# EAGLE design imu_hand (EAGLE 9.1.3)

## Sheet 1 of 2
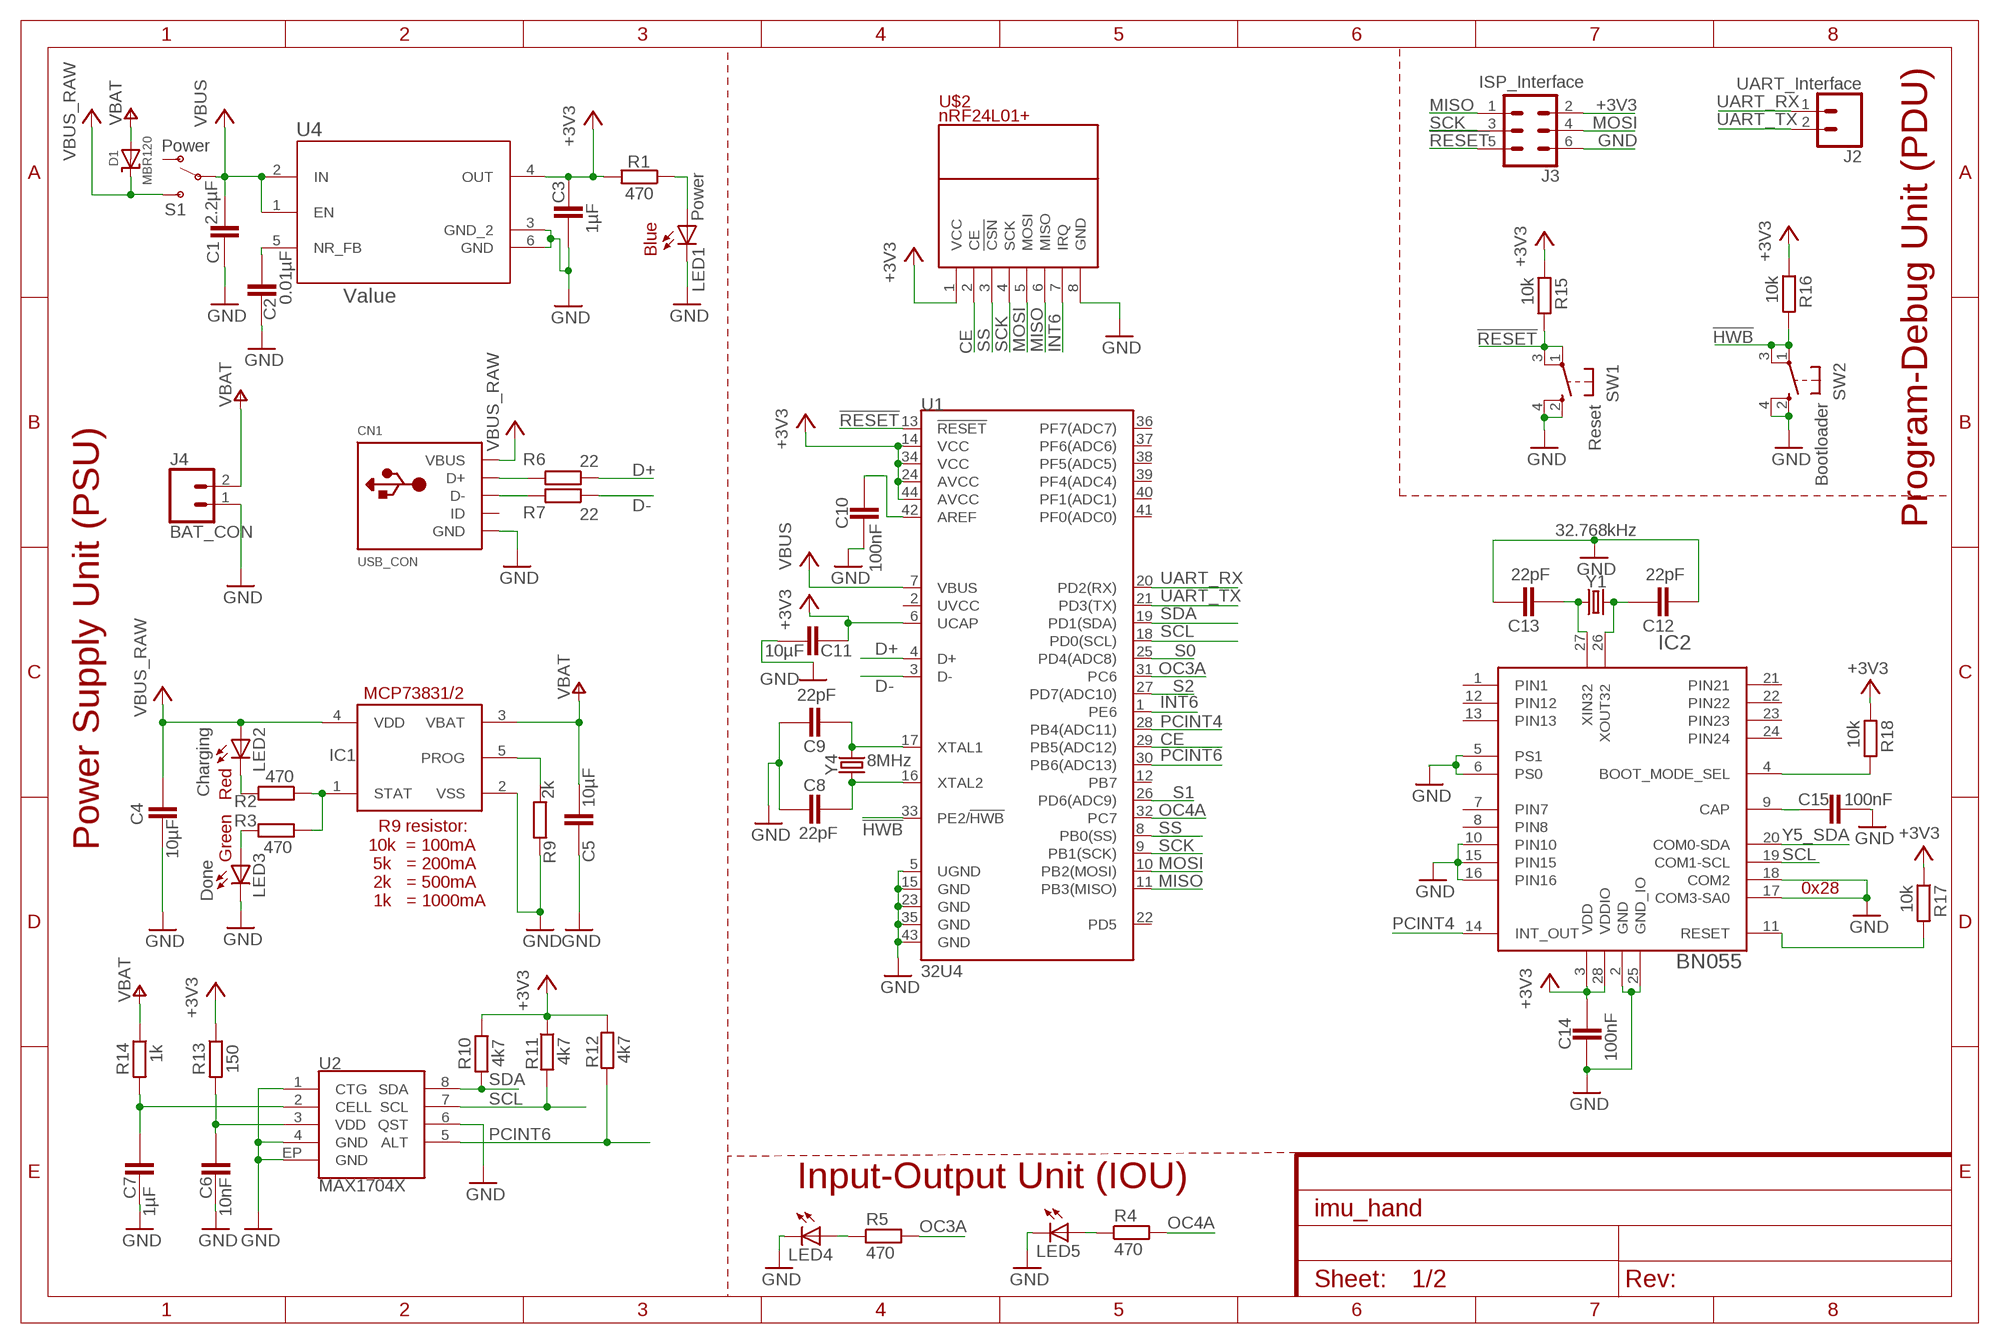
[diagram p0: schematic, sheet 1]

### Parts
C1  2.2µF  CAPACITOR_0603  [CAPC1608X92N]
C2  0.01µF  CAPACITOR_0603  [CAPC1608X92N]
C3  1µF  CAPACITOR_0603  [CAPC1608X92N]
C4  10µF  CAPACITOR_0603  [CAPC1608X92N]
C5  10µF  CAPACITOR_0603  [CAPC1608X92N]
C6  10nF  CAPACITOR_0603  [CAPC1608X92N]
C7  1µF  CAPACITOR_0603  [CAPC1608X92N]
C8  22pF  CAPACITOR_0603  [CAPC1608X92N]
C9  22pF  CAPACITOR_0603  [CAPC1608X92N]
C10  100nF  CAPACITOR_0603  [CAPC1608X92N]
C11  10µF  CAPACITOR_0603  [CAPC1608X92N]
C12  22pF  CAPACITOR_0603  [CAPC1608X92N]
C13  22pF  CAPACITOR_0603  [CAPC1608X92N]
C14  100nF  CAPACITOR_0603  [CAPC1608X92N]
C15  100nF  CAPACITOR_0603  [CAPC1608X92N]
CN1  USB_CON  USBMINIB  [USB-MINIB]
D1  MBR120  DIODE_SOD-123FL  [SOD-123FL]
IC1  MCP73831/OT  [SOT23-5L]
IC2  BN055  1658_BNO055  [LGA-28_3.80X5.20/0.5]
J2  UART_Interface  CONN_02  [1X02]
J3  ISP_Interface  CONN_03X2FEMALE  [2X3]
J4  BAT_CON  CONN_02  [1X02]
LED1  Power  LEDCHIPLED_0603  [CHIPLED_0603]
LED2  Charging  LEDCHIPLED_0603  [CHIPLED_0603]
LED3  Done  LEDCHIPLED_0603  [CHIPLED_0603]
LED4  LEDCHIPLED_0603  [CHIPLED_0603]
LED5  LEDCHIPLED_0603  [CHIPLED_0603]
R1  470  RESISTOR_0603  [RESC1608X55N]
R2  470  RESISTOR_0603  [RESC1608X55N]
R3  470  RESISTOR_0603  [RESC1608X55N]
R4  470  RESISTOR_0603  [RESC1608X55N]
R5  470  RESISTOR_0603  [RESC1608X55N]
R6  22  RESISTOR_0603  [RESC1608X55N]
R7  22  RESISTOR_0603  [RESC1608X55N]
R9  2k  RESISTOR_0603  [RESC1608X55N]
R10  4k7  RESISTOR_0603  [RESC1608X55N]
R11  4k7  RESISTOR_0603  [RESC1608X55N]
R12  4k7  RESISTOR_0603  [RESC1608X55N]
R13  150  RESISTOR_0603  [RESC1608X55N]
R14  1k  RESISTOR_0603  [RESC1608X55N]
R15  10k  RESISTOR_0603  [RESC1608X55N]
R16  10k  RESISTOR_0603  [RESC1608X55N]
R17  10k  RESISTOR_0603  [RESC1608X55N]
R18  10k  RESISTOR_0603  [RESC1608X55N]
S1  Power  SWITCH-SPDT-PTH-11.6X4.0MM  [SWITCH_SPDT_PTH_11.6X4.0MM]
SW1  Reset  SPST_TACT-KMR2  [KMR2]
SW2  Bootloader  SPST_TACT-KMR2  [KMR2]
U1  32U4  ATMEGA32U4TQFP-44  [TQFP44]
U2  MAX1704X  [TDFN-8]
U4  Value  TPS79633QDCQRQ1  [DCQ0006A_N]
U$2  nRF24L01+  6-PIN-BREAKOUT6-PIN-BREAKOUT  [6-PIN-BREAKOUT]
Y1  32.768kHz  CRYSTAL-32.768KHZSMD-3.2X1.5  [CRYSTAL-SMD-3.2X1.5MM]
Y4  8MHz  CRYSTAL-8MHZSMD-5X3.2  [CRYSTAL-SMD-5X3.2-4PAD]

### Nets
!HWB!: R16.2 SW2.1(P) SW2.3(P1) U1.33(PE2/!HWB)
!RESET!: J3.5 R15.2 SW1.1(P) SW1.3(P1) U1.13(!RESET)
+3V3: C3.2 C11.1 C14.1 IC2.3(VDD) IC2.28(VDDIO) J3.2 R1.2 R10.1 R11.1 R12.1 R13.1 R15.1 R16.1 R17.1 R18.1 U1.6(UCAP) U1.14(VCC) U1.24(AVCC) U1.34(VCC) U1.44(AVCC) U4.4(OUT) U$2.1(VCC) ; also sheet 2
CE: U1.29(PB5(ADC12)) U$2.2(CE)
D+: R6.1 U1.4(D+)
D-: R7.1 U1.3(D-)
GND: C1.1 C2.1 C3.1 C4.1 C5.1 C6.1 C7.1 C8.2 C9.2 C10.2 C11.2 C12.1 C13.2 C14.2 C15.2 CN1.GND IC1.2(VSS) IC2.2(GND) IC2.5(PS1) IC2.6(PS0) IC2.10(PIN10) IC2.15(PIN15) IC2.16(PIN16) IC2.17(COM3-SA0) IC2.18(COM2) IC2.25(GND_IO) J3.6 J4.1 LED1.C LED3.C LED4.C LED5.C R9.2 SW1.2(S) SW1.4(S1) SW2.2(S) SW2.4(S1) U1.5(UGND) U1.15(GND) U1.23(GND) U1.35(GND) U1.43(GND) U2.1(CTG) U2.4(GND) U2.6(QST) U2.EP(GND) U4.3(GND_2) U4.6(GND) U$2.8(GND) ; also sheet 2
INT6: U1.1(PE6) U$2.7(IRQ)
MISO: J3.1 U1.11(PB3(MISO)) U$2.6(MISO)
MOSI: J3.4 U1.10(PB2(MOSI)) U$2.5(MOSI)
N$1: CN1.D+ R6.2
N$2: CN1.D- R7.2
N$3: IC1.5(PROG) R9.1
N$4: LED2.C R2.2
N$5: C2.2 U4.5(NR_FB)
N$6: C13.1 IC2.27(XIN32) Y1.P$1
N$7: LED1.A R1.1
N$8: IC1.1(STAT) R2.1 R3.1
N$9: LED3.A R3.2
N$10: C9.1 U1.17(XTAL1) Y4.3
N$11: C8.1 U1.16(XTAL2) Y4.1
N$12: C10.1 U1.42(AREF)
N$13: C6.2 R13.2 U2.3(VDD)
N$14: C7.2 R14.2 U2.2(CELL)
N$15: LED4.A R5.1
N$16: C12.2 IC2.26(XOUT32) Y1.P$2
N$17: LED5.A R4.1
N$19: IC2.11(RESET) R17.2
N$20: C15.1 IC2.9(CAP)
N$21: IC2.4(BOOT_MODE_SEL) R18.2
OC3A: R5.2 U1.31(PC6)
OC4A: R4.2 U1.32(PC7)
PCINT4: IC2.14(INT_OUT) U1.28(PB4(ADC11))
PCINT6: R12.2 U1.30(PB6(ADC13)) U2.5(ALT)
S0: U1.25(PD4(ADC8)) ; also sheet 2
S1: U1.26(PD6(ADC9)) ; also sheet 2
S2: U1.27(PD7(ADC10)) ; also sheet 2
SCK: J3.3 U1.9(PB1(SCK)) U$2.4(SCK)
SCL: IC2.19(COM1-SCL) R11.2 U1.18(PD0(SCL)) U2.7(SCL) ; also sheet 2
SDA: R10.2 U1.19(PD1(SDA)) U2.8(SDA) ; also sheet 2
SS: U1.8(PB0(SS)) U$2.3(!CSN!)
UART_RX: J2.1 U1.20(PD2(RX))
UART_TX: J2.2 U1.21(PD3(TX))
VBAT: C5.2 D1.A IC1.3(VBAT) J4.2 R14.1
VBUS: C1.2 S1.2(P) U1.7(VBUS) U4.1(EN) U4.2(IN)
VBUS_RAW: C4.2 CN1.VBUS D1.C IC1.4(VDD) LED2.A S1.3(S)
Y5_SDA: IC2.20(COM0-SDA) ; also sheet 2
Unconnected: CN1.ID IC2.1(PIN1) IC2.7(PIN7) IC2.8(PIN8) IC2.12(PIN12) IC2.13(PIN13) IC2.21(PIN21) IC2.22(PIN22) IC2.23(PIN23) IC2.24(PIN24) S1.1(O) U1.2(UVCC) U1.12(PB7) U1.22(PD5) U1.36(PF7(ADC7)) U1.37(PF6(ADC6)) U1.38(PF5(ADC5)) U1.39(PF4(ADC4)) U1.40(PF1(ADC1)) U1.41(PF0(ADC0))

### Notes on the sheet
- Program-Debug Unit (PDU)
- nRF24L01+
- Blue
- Red
- Power Supply Unit (PSU)
- Green
- 0x28
- R9 resistor:
  10k  = 100mA
   5k   = 200mA
   2k   = 500mA
   1k   = 1000mA
- Input-Output Unit (IOU)

## Sheet 2 of 2
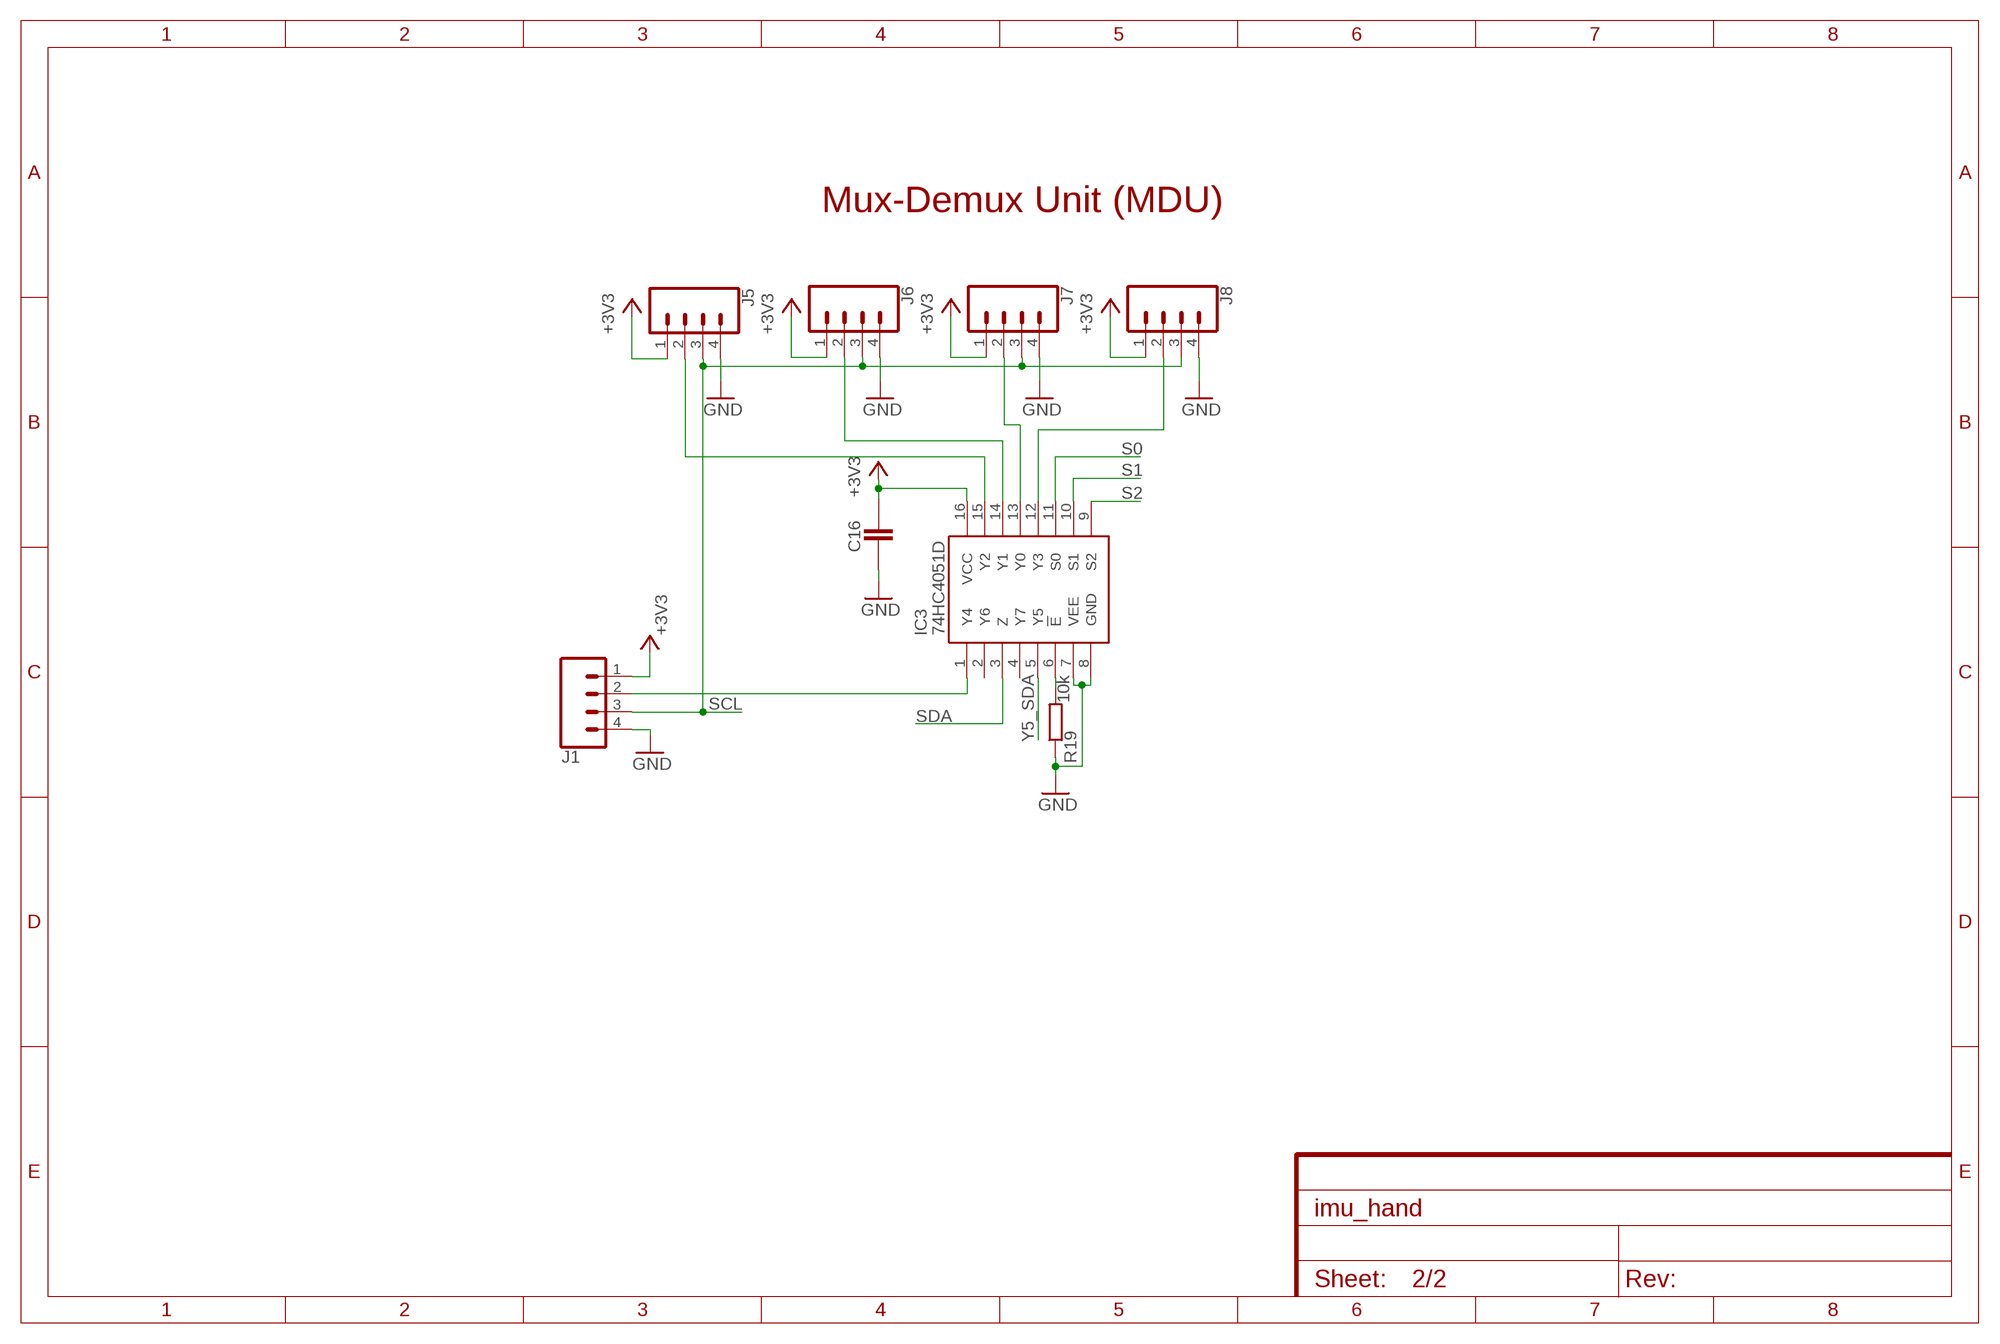
[diagram p1: schematic, sheet 2]

### Parts
C16  CAPACITOR_0603  [CAPC1608X92N]
IC3  74HC4051D  [SOIC127P600X175-16N]
J1  CONN_04SMD2  [1X04_1MM_RA]
J5  CONN_04SMD2  [1X04_1MM_RA]
J6  CONN_04SMD2  [1X04_1MM_RA]
J7  CONN_04SMD2  [1X04_1MM_RA]
J8  CONN_04SMD2  [1X04_1MM_RA]
R19  10k  RESISTOR_0603  [RESC1608X55N]

### Nets
+3V3: C16.2 IC3.16(VCC) J1.1 J5.1 J6.1 J7.1 J8.1 ; also sheet 1
GND: C16.1 IC3.7(VEE) IC3.8(GND) J1.4 J5.4 J6.4 J7.4 J8.4 R19.1 ; also sheet 1
N$18: IC3.1(Y4) J1.2
N$22: IC3.15(Y2) J5.2
N$23: IC3.14(Y1) J6.2
N$24: IC3.13(Y0) J7.2
N$25: IC3.12(Y3) J8.2
N$26: IC3.6(!E) R19.2
S0: IC3.11(S0) ; also sheet 1
S1: IC3.10(S1) ; also sheet 1
S2: IC3.9(S2) ; also sheet 1
SCL: J1.3 J5.3 J6.3 J7.3 J8.3 ; also sheet 1
SDA: IC3.3(Z) ; also sheet 1
Y5_SDA: IC3.5(Y5) ; also sheet 1
Unconnected: IC3.2(Y6) IC3.4(Y7)

### Notes on the sheet
- Mux-Demux Unit (MDU)

## Library data of the parts
C1-C16 = ipc-7351-capacitor:CAPACITOR_
CN1 = adafruit:USB: USB Connectors USBMINIB - Surface Mount Female Mini-B USB Connector 4UConnector: 06564 By microbuilder.eu Thru-hole RA Female Mini-B USB Connector 4UConnector: 18732 By ladyada.net
D1 = adafruit:DIODE: Diode SMADIODE - SMA Surface Mount Package 20V 1A Schottky Diode Digikey: 641-1014-6-ND DO-1N4148 - Through Hole Small Current Diode SOD-123 20V 1 A (.5mV Vf) Schottky Diode - Digikey: MBRX120TPMSCT-ND SOD-323 10V 570mA (.38mV Vf, 3ns) Schottky Diode - Digikey: ZLLS410CT-ND SOD-523 30V 30mA Schottky Diode (RB751S-40TE61) - Digikey: RB751S-40TE61CT-ND SOT23-R/W - SOT23 Package (R = Solder Paste/Reflow Ovens, W = Hand-Soldering) BAT54Film 40V 300mA - Digikey: 497-7162-1-ND
IC1 = adafruit:MCP73831: MCP73831/2 Miniature Single-Cell, Fully Integrated Li-Ion, Li-Polymer Charge Management Controllers. Nice and small simple lipoly charge controller, with adjustable current and status output (LED) http://www.ladyada.net/library/pcb/eaglelibrary.html
IC2 = BNO055:1658_BNO055: BN055 Intelligent 9-axis absolute orientation sensor; PART_NUMBER: BNO055
IC3 = 74HC4051D:74HC4051D: NXP 74HC4051D, Multiplexer/Demultiplexer Single 8:1, 5 V, 16-Pin SOIC Source: Datasheet <https://assets.nexperia.com/documents/data-sheet/74HC_HCT4051.pdf>; ARROW_PART_NUMBER: 74HC4051D; ARROW_PRICE-STOCK: http://uk.rs-online.com/web/p/products/1697756P; DESCRIPTION: NXP 74HC4051D, Multiplexer/Demultiplexer Single 8:1, 5 V, 16-Pin SOIC; HEIGHT: 1.75mm; MANUFACTURER_NAME: Nexperia; MANUFACTURER_PART_NUMBER: 74HC4051D; RS_PART_NUMBER: 1697756P; RS_PRICE-STOCK: http://uk.rs-online.com/web/p/products/1697756P
J1 J5-J8 = SparkFun-Connectors:CONN_04: Multi connection point. Often used as Generic Header-pin footprint for 0.1 inch spaced/style header connections On any of the 0.1 inch spaced packages, you can populate with these: Break Away Headers - Straight <https://www.sparkfun.com/products/116> (PRT-00116) Break Away Male Headers - Right Angle <https://www.sparkfun.com/products/553> (PRT-00553) Female Headers <https://www.sparkfun.com/products/115> (PRT-00115) Break Away Headers - Machine Pin <https://www.sparkfun.com/products/117> (PRT-00117) Break Away Female Headers - Swiss Machine Pin <https://www.sparkfun.com/products/743> (PRT-00743) For SCREWTERMINALS and SPRING TERMINALS visit here: Screw Terimnals on SparkFun.com <https://www.sparkfun.com/search/results?term=Screw+Terminals> (5mm/3.5mm/2.54mm spacing) This device is also useful as a general connection point to wire up your design to another part of your project. Our various solder wires solder well into these plated through hole pads. Hook-Up Wire - Assortment (Stranded, 22 AWG) <https://www.sparkfun.com/products/11375> (PRT-11375) Hook-Up Wire - Assortment (Solid Core, 22 AWG) <https://www.sparkfun.com/products/11367> (PRT-11367) View the entire wire category on our website here <https://www.sparkfun.com/categories/141> Special notes: Molex polarized connector foot print use with SKU : PRT-08231 with associated crimp pins and housings. 1MM SMD Version SKU: PRT-10208; PROD_ID: CONN-10310; SF_ID: PRT-10208
J2 J4 = SparkFun-Connectors:CONN_02: Multi connection point. Often used as Generic Header-pin footprint for 0.1 inch spaced/style header connections On any of the 0.1 inch spaced packages, you can populate with these: Break Away Headers - Straight <https://www.sparkfun.com/products/116> (PRT-00116) Break Away Male Headers - Right Angle <https://www.sparkfun.com/products/553> (PRT-00553) Female Headers <https://www.sparkfun.com/products/115> (PRT-00115) Break Away Headers - Machine Pin <https://www.sparkfun.com/products/117> (PRT-00117) Break Away Female Headers - Swiss Machine Pin <https://www.sparkfun.com/products/743> (PRT-00743) For SCREWTERMINALS and SPRING TERMINALS visit here: Screw Terimnals on SparkFun.com <https://www.sparkfun.com/search/results?term=Screw+Terminals> (5mm/3.5mm/2.54mm spacing) This device is also useful as a general connection point to wire up your design to another part of your project. Our various solder wires solder well into these plated through hole pads. Hook-Up Wire - Assortment (Stranded, 22 AWG) <https://www.sparkfun.com/products/11375> (PRT-11375) Hook-Up Wire - Assortment (Solid Core, 22 AWG) <https://www.sparkfun.com/products/11367> (PRT-11367) View the entire wire category on our website here <https://www.sparkfun.com/categories/141> Special notes: Molex polarized connector foot print use with: PRT-08233 with associated crimp pins and housings. 2.54_SCREWTERM for use with PRT-10571. 3.5mm Screw Terminal footprints for PRT-08084 5mm Screw Terminal footprints for use with PRT-08432
J3 = SparkFun-Connectors:CONN_03X2: Multi connection point. Often used as Generic Header-pin footprint for 0.1 inch spaced/style header connections You can populate with any combo of single row headers, but if you'd like an exact match, check these: Header - 2x3 (Male, 0.1") <https://www.sparkfun.com/products/12807> (PRT-12807) Header - 2x3 (Female, 0.1") <https://www.sparkfun.com/products/13010> (PRT-13010) 2x3 Pin Shrouded Header <https://www.sparkfun.com/products/10877> (PRT-10877) On any of the 0.1 inch spaced packages, you can populate with these: Break Away Headers - Straight <https://www.sparkfun.com/products/116> (PRT-00116) Break Away Male Headers - Right Angle <https://www.sparkfun.com/products/553> (PRT-00553) Female Headers <https://www.sparkfun.com/products/115> (PRT-00115) Break Away Headers - Machine Pin <https://www.sparkfun.com/products/117> (PRT-00117) Break Away Female Headers - Swiss Machine Pin <https://www.sparkfun.com/products/743> (PRT-00743) Special note: the shrouded connector mates well with our 3x2 ribbon cables: Ribbon Crimp Connector - 6-pin (2x3, Female) <https://www.sparkfun.com/products/10651> (PRT-10651) Ribbon Cable - 6 wire (15ft) <https://www.sparkfun.com/products/10646> (PRT-10646); PROD_ID: CONN-11566; VALUE: FEMALE 2x3
LED1-LED5 = adafruit:LED: LED OSRAM: - CHIPLED LG R971, LG N971, LY N971, LG Q971, LY Q971, LO R971, LY R971 LH N974, LH R974 LS Q976, LO Q976, LY Q976 LO Q996 - Hyper CHIPLED LW Q18S LB Q993, LB Q99A, LB R99A - SideLED LS A670, LO A670, LY A670, LG A670, LP A670 LB A673, LV A673, LT A673, LW A673 LH A674 LY A675 LS A676, LA A676, LO A676, LY A676, LW A676 LS A679, LY A679, LG A679 - Hyper Micro SIDELED® LS Y876, LA Y876, LO Y876, LY Y876 LT Y87S - SmartLED LW L88C, LW L88S LB L89C, LB L89S, LG L890 LS L89K, LO L89K, LY L89K LS L896, LA L896, LO L896, LY L896 - TOPLED LS T670, LO T670, LY T670, LG T670, LP T670 LSG T670, LSP T670, LSY T670, LOP T670, LYG T670 LG T671, LOG T671, LSG T671 LB T673, LV T673, LT T673, LW T673 LH T674 LS T676, LA T676, LO T676, LY T676, LB T676, LH T676, LSB T676, LW T676 LB T67C, LV T67C, LT T67C, LS T67K, LO T67K, LY T67K, LW E67C LS E67B, LA E67B, LO E67B, LY E67B, LB E67C, LV E67C, LT E67C LW T67C LS T679, LY T679, LG T679 LS T770, LO T770, LY T770, LG T770, LP T770 LB T773, LV T773, LT T773, LW T773 LH T774 LS E675, LA E675, LY E675, LS T675 LS T776, LA T776, LO T776, LY T776, LB T776 LHGB T686 LT T68C, LB T68C - Hyper Mini TOPLED® LB M676 - Mini TOPLED Santana® LG M470 LS M47K, LO M47K, LY M47K Source: http://www.osram.convergy.de/
R1-R7 R9-R19 = ipc-7351-resistor:RESISTOR_
S1 = SparkFun-Switches:SWITCH-SPDT: Single Pole, Double Throw (SPDT) Switch Single-pole, double-throw (SPDT) switch. Variant Overview SMD-AYZ0202 Surface Mount DPDT Switch <https://www.sparkfun.com/products/597> (COM-00597) Used on e.g. LilyPad Arduino USB - ATmega32U4 Board <https://www.sparkfun.com/products/12049> PTH-11.6X4.0MM SPDT Mini Power Switch <https://www.sparkfun.com/products/102> (COM-00102) Used on e.g. SparkFun Simon Says - Through-Hole Soldering Kit <https://www.sparkfun.com/products/10547> (KIT-10547) PTH-11.6X4.0MM-KIT KIT version of SPDT Mini Power Switch - Simplifies soldering by removing tStop of switch pins - only one side can be soldered. PTH-11.6X4.0MM-LOCK LOCK version of SPDT Mini Power Switch - Offset pins hold switch in place for easier soldering. SMD-RIGHT-ANGLE Surface Mount Right Angle Switch <https://www.sparkfun.com/products/10860> (COM-10860) Used on e.g. SparkFun ESP8266 Thing <https://www.sparkfun.com/products/13231>; PROD_ID: SWCH-08261; SF_SKU: COM-00102
SW1 SW2 = adafruit:SPST_TACT: SMT 6mm switch, EVQQ2 series http://www.ladyada.net/library/eagle
U1 = SparkFun-IC-Microcontroller:ATMEGA32U4: Atmel MCU, 32KByte Atmel 44-pin 8-bit Microcontroller with 32KBytes of ISP Flash and USB Controller Datasheet <http://cdn.sparkfun.com/datasheets/Dev/Arduino/Boards/ATMega32U4.pdf> SparkFun Products LilyPad Arduino USB - ATmega32U4 Board <https://www.sparkfun.com/products/12049> (DEV-12049) Pro Micro - 5V/16MHz <https://www.sparkfun.com/products/12640> (DEV-12640) Pro Micro - 3.3V/8MHz <https://www.sparkfun.com/products/12587> (DEV-12587) Fio v3 - ATmega32U4 <https://www.sparkfun.com/products/11520> (DEV-11520) Qduino Mini <https://www.sparkfun.com/products/13614> (DEV-13614) Makey Makey - Standard Kit <https://www.sparkfun.com/products/11511> (WIG-11511) Makey Makey Deluxe Kit <https://www.sparkfun.com/products/11519> (WIG-11519); PROD_ID: IC-11161
U2 = SparkFun-IC-Power:MAX1704X: MAX17043/MAX17044: Battery Fuel Guage (43 is 1cell, 44 is 2cell); PROD-ID: IC-10399
U4 = TPS79633-Q1:TPS79633QDCQRQ1; MANUFACTURER: Texas Instruments; PARTNUMBER: TPS79633QDCQRQ1; REFDES: RefDes; TYPE: TYPE
U$2 = SparkFun-nRF24L01+:6-PIN-BREAKOUT
Y1 = SparkFun-Clocks:CRYSTAL-32.768KHZ: 32.768kHz Crystal Frequency: 32.768kHz Frequency Stability: ±20ppm Load Capacitance: 12.5pF (PTH-2X6 & SMD-3.2X1.5), 6pF (SMD-2X6) SparkFun Products: SparkFun BigTime Watch Kit <https://www.sparkfun.com/products/11734> SparkFun nRF52832 Breakout <https://www.sparkfun.com/products/13990> SparkFun Real Time Clock Module <https://www.sparkfun.com/products/12708>; PROD_ID: XTAL-13062
Y4 = SparkFun-Clocks:CRYSTAL-8MHZ: 8MHz Crystal Datasheet Example <http://www.futureelectronics.com/en/technologies/electromechanical/timing-devices/crystals/Pages/6008189-ABM3B-8.000MHZ-B2-T.aspx?IM=0> Frequency: 8MHz Frequency Tolerance: ±20ppm Load Capacitance: 18pF SparkFun Products: Pro Micro -3.3V/8MHz <https://www.sparkfun.com/products/12587> WAV Trigger <https://www.sparkfun.com/products/13660>; PROD_ID: XTAL-09431

## Board
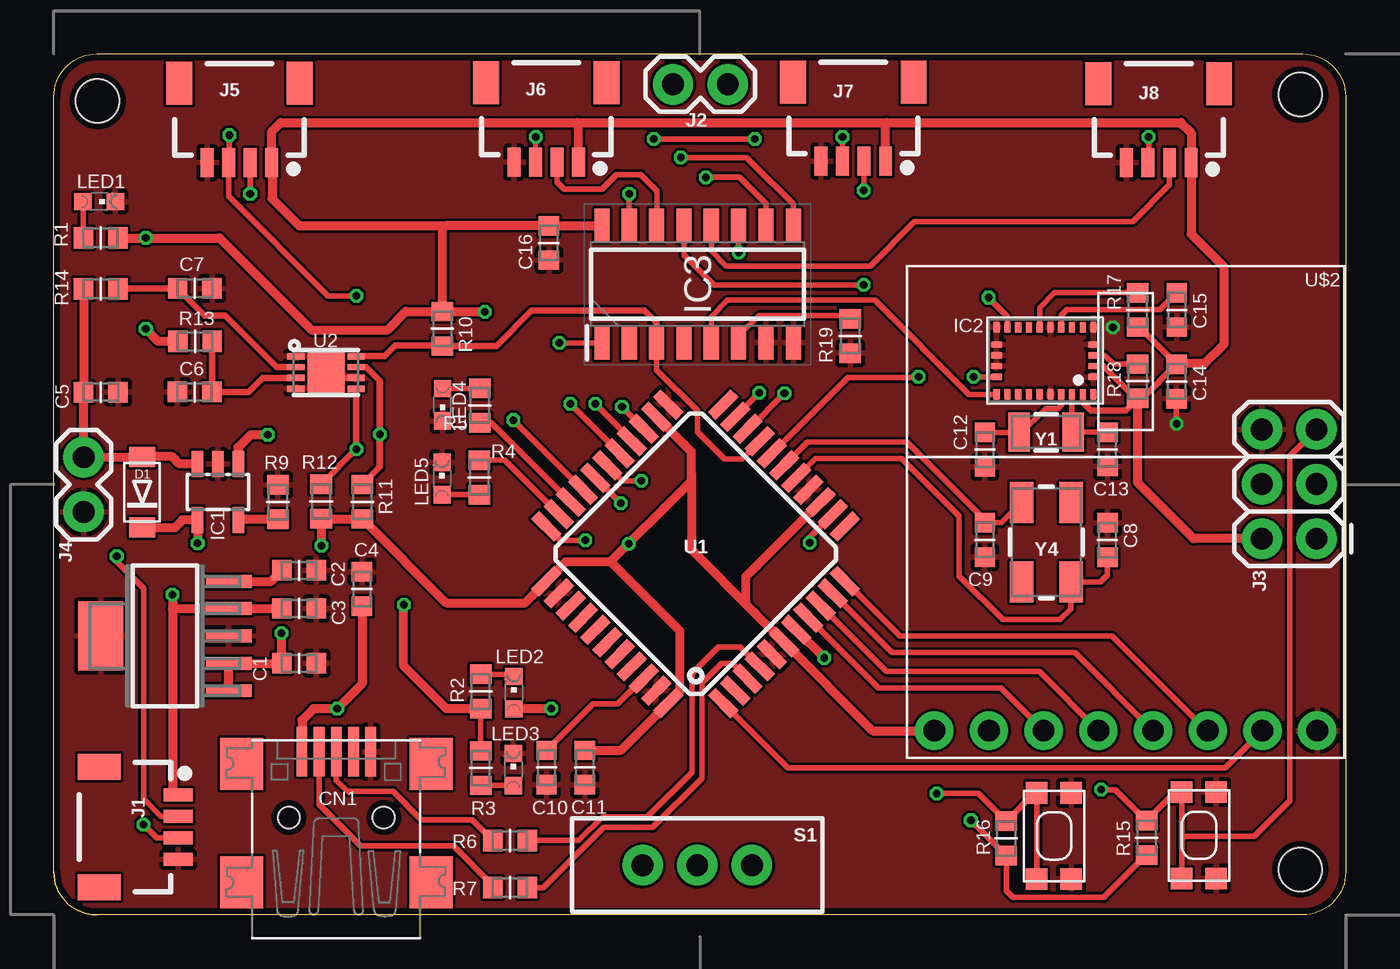
[diagram p2: board, top side]
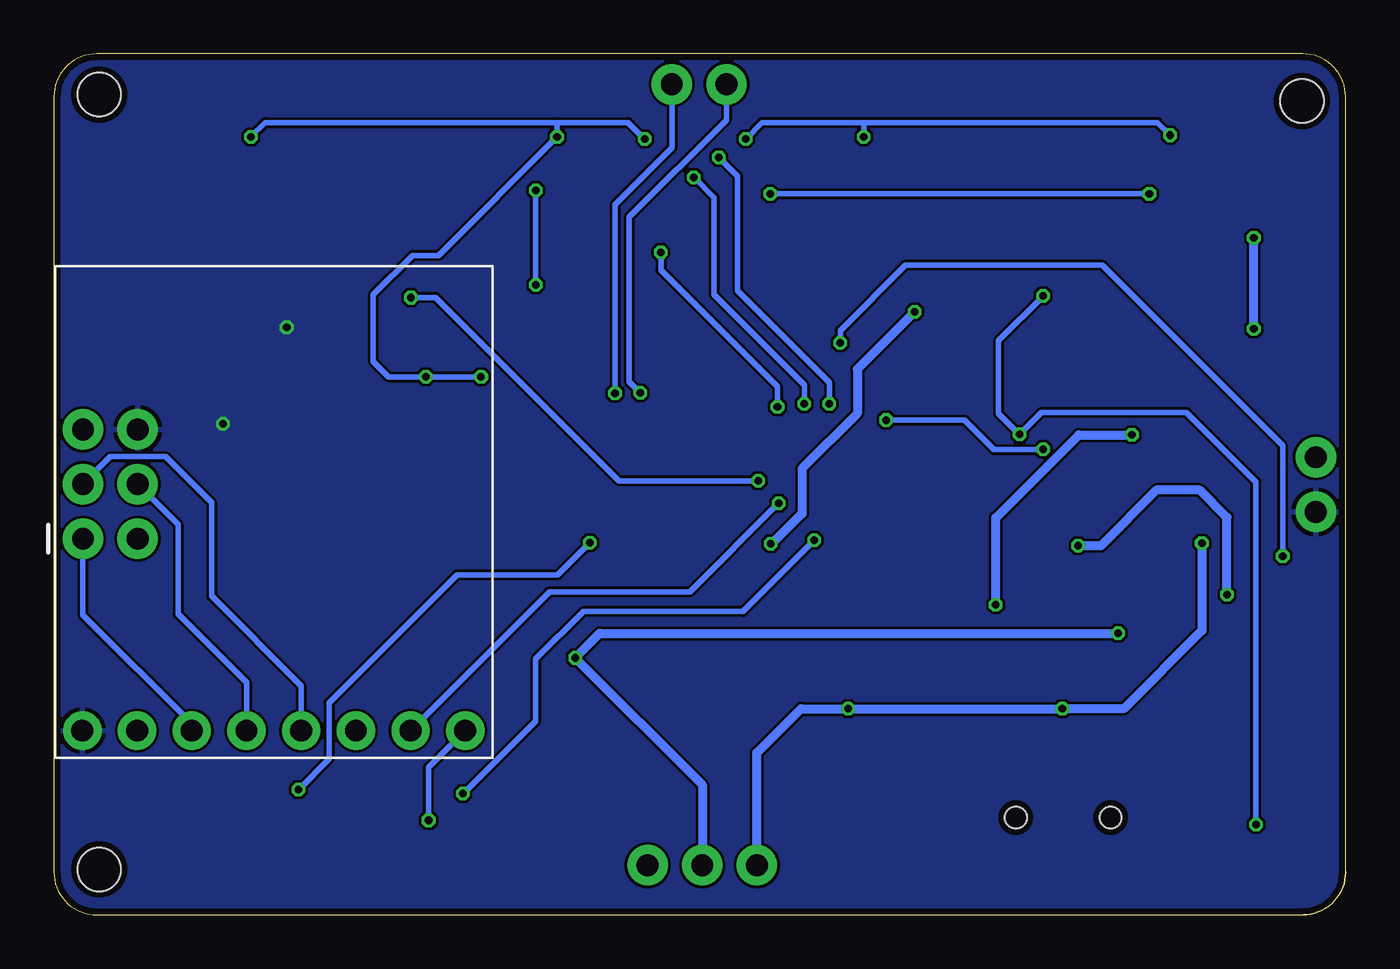
[diagram p3: board, bottom side, seen from below]

Size 60 x 40 mm. Coordinates in mm from the lower left corner, seen from the top.
Outline: 0,2 arc90 2,0
Outline: 2,0 58,0 arc90 60,2 60,38 arc90 58,40 2,40 arc90 0,38 0,2
Outline: 2,0 arc-90 0,2
Copper layers (1*16): Top 0.035mm / dielectric 1.5mm / Bottom 0.035mm
Design rules "PCB-POOL HighSpec": minimum track width 0.125mm, minimum drill 0.2mm, track to track 0.125mm, track to pad 0.125mm, pad to pad 0.125mm, via to via 0.125mm, smd to smd 0.125mm, copper to edge 0.3mm, drill to drill 0.2mm, minimum pad ring 0.2mm, minimum via ring 0.125mm, stop-mask expansion 0.075mm, vias tented up to drill 0mil, thermal gap 0.2mm
Holes 2 mm at 57.89,2.11 2.03,37.81 57.89,38.11

### Footprints (pad centres in the part's own frame; a part is rotated, then mirrored left to right if it is on the bottom)
CAPC1608X92N = smd 0.9 x 0.95: 1 -0.8,0; 2 0.8,0
USB-MINIB = smd 0.5 x 2.308: D+ 0,4.064; D- -0.8,4.064; GND 1.6,4.064; ID 0.8,4.064; VBUS -1.6,4.064 | smd 2 x 2.4: GND1 -4.4,-2; GND2 -4.4,3.5; GND3 4.4,3.5; GND4 4.4,-2 | hole 1: -2.2,1; 2.2,1
SOD-123FL = smd 0.91 x 1.22: A 1.637,0; C -1.637,0
SOT23-5L = smd 0.55 x 1.2: 1 -0.95,-1.3; 2 0,-1.3; 3 0.95,-1.3; 4 0.95,1.3; 5 -0.95,1.3
LGA-28_3.80X5.20/0.5 = smd 0.3 x 0.5: 1 -2.25,1.56; 6 -2.25,-1.56; 7 -1.75,-1.56; 8 -1.25,-1.56; 9 -0.75,-1.56; 10 -0.25,-1.56; 11 0.25,-1.56; 12 0.75,-1.56; 13 1.25,-1.56; 14 1.75,-1.56; 15 2.25,-1.56; 20 2.25,1.56; 21 1.75,1.56; 22 1.25,1.56; 23 0.75,1.56; 24 0.25,1.56; 25 -0.25,1.56; 26 -0.75,1.56; 27 -1.25,1.56; 28 -1.75,1.56 | smd 0.5 x 0.3: 2 -2.25,0.75; 3 -2.25,0.25; 4 -2.25,-0.25; 5 -2.25,-0.75; 16 2.25,-0.75; 17 2.25,-0.25; 18 2.25,0.25; 19 2.25,0.75
SOIC127P600X175-16N = smd 1.55 x 0.7: 1 -2.725,4.445; 2 -2.725,3.175; 3 -2.725,1.905; 4 -2.725,0.635; 5 -2.725,-0.635; 6 -2.725,-1.905; 7 -2.725,-3.175; 8 -2.725,-4.445; 9 2.725,-4.445; 10 2.725,-3.175; 11 2.725,-1.905; 12 2.725,-0.635; 13 2.725,0.635; 14 2.725,1.905; 15 2.725,3.175; 16 2.725,4.445
1X04_1MM_RA = smd 0.6 x 1.35: 1 -1.5,0; 2 -0.5,0; 3 0.5,0; 4 1.5,0 | smd 1.2 x 2: NC1 2.8,-3.675; NC2 -2.8,-3.675
1X02 = drill 1.016 pad 1.88: 1 0,0; 2 2.54,0
2X3 = drill 1.016 pad 1.88: 1 0,0; 2 0,2.54; 3 2.54,0; 4 2.54,2.54; 5 5.08,0; 6 5.08,2.54
CHIPLED_0603 = smd 0.8 x 0.8: A 0,-0.75; C 0,0.75
RESC1608X55N = smd 0.9 x 1: 1 -0.8,0; 2 0.8,0
SWITCH_SPDT_PTH_11.6X4.0MM = drill 1.016 pad 1.88: 1 0,2.54; 2 0,0; 3 0,-2.54
KMR2 = smd 1 x 1: 1 2,0.8; 2 2,-0.8; 3 -2,0.8; 4 -2,-0.8
TQFP44 = smd 1.5 x 0.5: 1 -5.8,4; 2 -5.8,3.2; 3 -5.8,2.4; 4 -5.8,1.6; 5 -5.8,0.8; 6 -5.8,0; 7 -5.8,-0.8; 8 -5.8,-1.6; 9 -5.8,-2.4; 10 -5.8,-3.2; 11 -5.8,-4; 23 5.8,-4; 24 5.8,-3.2; 25 5.8,-2.4; 26 5.8,-1.6; 27 5.8,-0.8; 28 5.8,0; 29 5.8,0.8; 30 5.8,1.6; 31 5.8,2.4; 32 5.8,3.2; 33 5.8,4 | smd 0.5 x 1.5: 12 -4,-5.8; 13 -3.2,-5.8; 14 -2.4,-5.8; 15 -1.6,-5.8; 16 -0.8,-5.8; 17 0,-5.8; 18 0.8,-5.8; 19 1.6,-5.8; 20 2.4,-5.8; 21 3.2,-5.8; 22 4,-5.8; 34 4,5.8; 35 3.2,5.8; 36 2.4,5.8; 37 1.6,5.8; 38 0.8,5.8; 39 0,5.8; 40 -0.8,5.8; 41 -1.6,5.8; 42 -2.4,5.8; 43 -3.2,5.8; 44 -4,5.8
TDFN-8 = smd 0.8 x 0.3: 1 -1.4,0.75; 2 -1.4,0.25; 3 -1.4,-0.25; 4 -1.4,-0.75; 5 1.4,-0.75; 6 1.4,-0.25; 7 1.4,0.25; 8 1.4,0.75 | smd 1.73 x 1.88: EP 0,0
DCQ0006A_N = smd 2.1 x 0.6: 1 -2.975,2.54; 2 -2.975,1.27; 3 -2.975,0; 4 -2.975,-1.27; 5 -2.975,-2.54 | smd 2.1 x 3.2: 6 2.975,0
6-PIN-BREAKOUT = drill 1.016 pad 1.778: 1 0,0; 2 2.54,0; 3 5.08,0; 4 7.62,0; 5 10.16,0; 6 12.7,0; 7 15.24,0; 8 17.78,0
CRYSTAL-SMD-3.2X1.5MM = smd 1 x 1.8: P$1 -1.25,0; P$2 1.25,0
CRYSTAL-SMD-5X3.2-4PAD = smd 1.9 x 1.1: 1 -1.85,-1.15; 2 1.85,-1.15; 3 1.85,1.15; 4 -1.85,1.15

### Placement (x,y rotation side)
C1  11.39,11.68 180 top
C2  11.39,16 180 top
C3  11.39,14.24 180 top
C4  14.31,15.14 270 top
C5  2.18,24.28 180 top
C6  6.54,24.29 0 top
C7  6.55,29.1 180 top
C8  48.93,17.41 90 top
C9  43.24,17.42 270 top
C10  22.89,6.85 270 top
C11  24.66,6.85 270 top
C12  43.24,21.62 90 top
C13  48.93,21.63 270 top
C14  52.15,24.78 270 top
C15  52.16,28.11 270 top
C16  22.99,31.21 90 top
CN1  13.12,3.52 0 top
D1  4.1,19.63 90 top
IC1  7.62,19.65 180 top
IC2  46.04,25.74 180 top
IC3  29.9,29.3 90 top
J1  5.78,4.08 270 top
J2  31.3,38.59 180 top
J3  58.65,17.48 90 top
J4  1.38,18.72 90 top
J5  8.62,34.95 180 top
J6  22.87,34.98 180 top
J7  37.13,35.01 180 top
J8  51.32,34.94 180 top
LED1  2.11,33.13 270 top
LED2  21.36,10.33 0 top
LED3  21.34,6.76 0 top
LED4  18.05,23.7 180 top
LED5  18.03,20.27 0 top
R1  2.17,31.45 0 top
R2  19.82,10.38 90 top
R3  19.82,6.82 270 top
R4  19.77,20.32 90 top
R5  19.78,23.66 270 top
R6  21.18,3.45 180 top
R7  21.18,1.27 180 top
R9  10.4,19.18 90 top
R10  18.05,27.23 270 top
R11  14.33,19.19 90 top
R12  12.42,19.21 90 top
R13  6.56,26.64 0 top
R14  2.18,29.08 0 top
R15  50.75,3.58 90 top
R16  44.23,3.56 90 top
R17  50.33,28.11 90 top
R18  50.34,24.79 90 top
R19  36.99,26.9 90 top
S1  29.88,2.31 270 top
SW1  53.19,3.7 90 top
SW2  46.45,3.67 90 top
U1  29.81,16.78 135 top
U2  12.64,25.2 0 top
U4  5.16,12.96 180 top
U$2  40.89,8.56 0 top
Y1  46.09,22.43 180 top
Y4  46.1,17.31 90 top

### Tracks (layer width: path | path; a pad name or v marks a point on that pad's centre or on a via)
!HWB!  (via drill 0.35)
  Top 0.254: v41.01,5.64 42.95,5.64 R16.2 45.55,5.67 SW2.1 SW2.3 | U1.33 23.53,17.4 v24.69,17.4
  Bottom 0.254: v24.69,17.4 27.99,14.1 35.41,14.1 37.62,11.89 37.62,8.99 41,5.61 41.01,5.62 v41.01,5.64
!RESET!  (via drill 0.35)
  Top 0.254: SW1.3 52.39,3.5 | 52.39,3.5 SW1.1 52.06,5.7 R15.2 49.31,5.82 v48.64,5.82 | J3.5 57.4,21.31 57.4,5.31 55.75,3.66 52.54,3.66 52.39,3.5 | U1.13 35.1,17.54 v35.1,17.3
  Bottom 0.254: v35.1,17.3 36.6,15.8 41.27,15.8 47.22,9.86 47.22,7.24 v48.64,5.82
+3V3  (via drill 0.35)
  Top 0.254: R18.1 50.29,23.99 50.35,23.99 50.56,23.99 C14.1 50.42,27.3 R17.1 | R15.1 48.77,0.81 44.55,0.81 44.23,1.12 R16.1 v42.59,4.39 | 6.58,14.23 U4.4
  Top 0.305: IC2.28 47.79,23.79 48.16,23.42 49.78,23.42 50.35,23.99 50.25,23.99 49.06,25.19 | IC2.3 48.75,25.49 49.06,25.19 | 49.06,25.19 | 18.04,28.04 R10.1
  Top 0.406: U$2.1 38.03,8.56 U1.6 32.52,14.06 | J3.2 52.93,17.48 50.35,20.05 50.35,23.99 | 32.52,14.06 32.13,14.45 32.13,15.7 32.66,16.23 U1.14 | U1.24 27.99,23.14 29.3,21.83 29.62,21.51 29.62,20.52 | U1.34 23.07,15.69 | 23.07,15.69 23.79,16.41 25.58,16.41 25.86,16.41 | 25.86,16.41 v26.7,17.25 28.36,18.91 29.62,20.17 29.62,20.52 | C11.1 26.34,7.64 U1.44 29.08,10.39 29.08,13.18 25.86,16.41 | C3.2 10.58,14.23 U4.4 5.51,14.23 | R12.1 12.43,18.39 | 12.43,18.39 R11.1 18.22,14.5 21.88,14.5 23.07,15.69 | v12.42,17.14 12.43,17.15 12.43,18.39 | 24.33,36.8 10.54,36.8 10.12,36.39 J5.1 10.13,34.94 10.13,33.27 11.39,32.02 18.16,32.02 | 24.33,36.8 38.66,36.8 | 38.66,36.8 52.35,36.8 52.82,36.33 J8.1 52.82,31.63 54.33,30.12 54.33,26.49 53.44,25.6 52.17,25.6 C14.1 | R1.2 v4.27,31.45 7.7,31.45 11.96,27.18 15.49,27.18 16.34,28.03 R10.1 | R13.1 4.86,26.64 v4.27,27.23 | v5.51,14.88 5.51,14.23 | 5.51,14.23 5.51,5.58 J1.1 | 29.62,20.52 29.62,16.97 32.52,14.06 | R10.1 | R10.1 18.05,31.91 18.16,32.02 | R10.1 20,28.03 v20.02,28.02 | J7.1 38.63,36.78 38.66,36.8 | J6.1 24.37,36.77 24.33,36.8 | 18.16,32.02 C16.2 23,32.02 IC3.16
  Bottom 0.254: v42.59,4.39 42.59,6.86 U$2.1
  Bottom 0.406: v5.51,14.88 5.51,18.47 6.78,19.74 8.79,19.74 11.38,17.14 v12.42,17.14 | v4.27,27.23 v4.27,31.45 | v20.02,28.02 22.68,25.35 22.68,23.29 25.25,20.73 25.25,18.64 26.67,17.22 26.7,17.22 v26.7,17.25
CE  (via drill 0.35)
  Top 0.254: U1.29 v26.33,19.13 v26.34,19.13
  Bottom 0.254: v26.34,19.13 30.45,15.01 36.98,15.01 U$2.2
D+
  Top 0.254: U1.4 31.88,12.45 30.86,12.45 29.64,11.23 29.64,6.63 27.56,4.55 25.47,4.55 24.38,3.45 R6.1
D-
  Top 0.254: U1.3 31.51,11.68 31.01,11.68 30.1,10.77 30.1,6.35 27.81,4.06 25.53,4.06 22.73,1.27 R7.1
GND  (via drill 0.35)
  Top 0.254: C14.2 v52.15,22.81
  Top 0.305: U2.EP 12.89,24.95 U2.6
  other vias: 49.19,27.29
  pour Top: 0,2 0,38 arc-90 2,40 58,40 arc-90 60,38 60,2 arc-90 58,0 2,0 arc-90
  pour Bottom: 0,2 0,38 arc-90 2,40 58,40 arc-90 60,38 60,2 arc-90 58,0 2,0 arc-90
INT6
  Top 0.254: U$2.7 54.41,6.83 34.1,6.83 U1.1
MISO
  Top 0.254: U1.11 39.29,12.95 49.15,12.95 53.54,8.56
  Top 0.406: 53.54,8.56 U$2.6
  Bottom 0.254: J3.1 58.65,13.95 53.59,8.89 U$2.6
MOSI
  Top 0.254: U1.10 38.92,12.19 47.42,12.19 U$2.5
  Bottom 0.254: J3.4 54.23,18.14 54.23,13.97 51.05,10.79 U$2.5
N$1
  Top 0.254: CN1.D+ 13.12,6.26 13.64,5.74 15.75,5.74 17.07,4.42 19.42,4.42 R6.2
N$2
  Top 0.254: CN1.D- 12.32,5.13 14.25,3.2 18.57,3.2 20.38,1.38 R7.2
N$3
  Top 0.406: R9.1 8.6,18.38 IC1.5
N$4
  Top 0.254: R2.2 21.26,11.18 LED2.C
N$5
  Top 0.406: U4.5 10.09,15.5 C2.2
N$6
  Top 0.254: IC2.27 47.29,22.48 Y1.P$1 C13.1 | C13.1
N$7
  Top 0.254: R1.1 1.37,33.12 LED1.A
N$8  (via drill 0.35)
  Top 0.254: R2.1 R3.1
  Top 0.406: R2.1 18.24,9.58 16.26,11.56 v16.26,14.4 | v9.93,22.3 9.14,22.3 8.56,21.72 8.57,21.71 IC1.1
  Bottom 0.406: v16.26,14.4 16.26,18.44 12.39,22.3 v9.93,22.3
N$9
  Top 0.254: LED3.A 21.32,6.02 R3.2
N$10
  Top 0.254: U1.17 35.01,21.97 39.62,21.97 43.24,18.35 C9.1 44.02,18.22 Y4.3
N$11
  Top 0.254: C8.1 48.93,15.79 48.61,15.46 Y4.1 47.24,14.22 46.74,13.72 44.07,13.72 42.04,15.75 42.04,18.54 39.37,21.21 35.38,21.21 U1.16
N$12
  Top 0.254: C10.1 25.04,9.8 26.19,9.8 27.36,10.98 U1.42
N$13
  Top 0.254: U2.3
  Top 0.305: U2.3 9.7,24.94 9.05,24.29 C6.2 7.36,24.31 R13.2
N$14
  Top 0.305: R14.2 3,29.1 C7.2 7.01,27.84 7.95,27.84 10.34,25.45 U2.2
N$15
  Top 0.254: LED4.A R5.1
  Top 0.305: R5.1
N$16
  Top 0.254: C12.2 44.83,22.41 Y1.P$2 44.97,22.43 46.08,23.53 46.65,23.53 46.79,23.67 IC2.26
N$17
  Top 0.254: LED5.A R4.1
  Top 0.305: R4.1
N$18  (via drill 0.35)
  Top 0.254: v2.92,16.66 2.92,16.41 4.17,15.16 4.17,6.45 4.17,5.38 4.97,4.58 J1.2 | v23.47,26.57 IC3.1
  Bottom 0.254: v2.92,16.66 2.92,21.79 11.3,30.18 20.45,30.18 23.47,27.15 v23.47,26.57
N$19
  Top 0.254: IC2.11 45.79,28.21 46.48,28.91 R17.2 | R17.2
N$20
  Top 0.254: IC2.9 46.79,27.86 47.04,28.12 51.37,28.12 C15.1
N$21
  Top 0.254: IC2.4 48.82,25.99 49.23,25.59 R18.2
N$22  (via drill 0.35)
  Top 0.254: IC3.15 26.73,33.24 26.72,33.25 v26.72,33.5 | v9.12,33.5 J5.2
  Bottom 0.254: v26.72,33.5 v9.12,33.5
N$23
  Top 0.254: J6.2 23.37,34.03 23.7,33.71 25.45,33.71 26.14,34.39 27.25,34.39 28.02,33.63 28.02,32.05 IC3.14
N$24  (via drill 0.35)
  Top 0.254: IC3.13 29.27,30.65 30.66,29.26 v37.62,29.26 | v37.62,33.66 37.62,35 J7.2
  Bottom 0.254: v37.62,29.26 v37.62,33.66
N$25
  Top 0.254: J8.2 51.82,33.91 50.11,32.21 39.98,32.21 37.92,30.15 31.22,30.15 30.54,30.83 IC3.12
N$26
  Top 0.254: R19.2 36.85,27.84 32.74,27.84 31.8,26.9 IC3.6
OC3A
  Top 0.254: R5.2 20.32,22.86 U1.31
  Top 0.305: U1.31
OC4A
  Top 0.254: R4.2 20.94,21.12 U1.32
PCINT4  (via drill 0.35)
  Top 0.254: U1.28 26.42,20.17 v27.28,20.17 | v43.41,28.68 44.29,27.8 IC2.14
  Bottom 0.254: v27.28,20.17 33.76,20.17 42.27,28.68 v43.41,28.68
PCINT6  (via drill 0.35)
  Top 0.254: U1.30 v21.34,22.99
  Top 0.305: R12.2 v14.04,21.63 U2.5
  Bottom 0.254: v21.34,22.99 17.7,22.99 16.33,21.61 14.06,21.61 v14.04,21.63
S0  (via drill 0.35)
  Top 0.254: v26.39,23.6 U1.25 | IC3.11 31.8,30.94 v31.8,30.79
  Bottom 0.254: v26.39,23.6 26.39,24.54 31.8,29.95 v31.8,30.79
S1  (via drill 0.35)
  Top 0.254: IC3.10 33.08,33.04 31.85,34.27 v30.28,34.27 | v25.15,23.75 26.84,22.05 U1.26
  Bottom 0.254: v30.28,34.27 29.34,33.33 29.34,32.16 29.34,28.8 25.15,24.61 v25.15,23.75
S2  (via drill 0.35)
  Top 0.254: IC3.9 34.34,33.02 32.41,34.95 32.18,35.18 v29.11,35.18 | v23.98,23.75 U1.27
  Bottom 0.254: v29.11,35.18 28.25,34.31 28.25,29.01 23.98,24.74 v23.98,23.75
SCK
  Top 0.254: U1.9 38.68,11.3 45.77,11.3 U$2.4
  Bottom 0.254: J3.3 57.38,21.29 54.81,21.29 52.68,19.15 52.68,14.81 48.51,10.64 U$2.4
SCL  (via drill 0.35)
  Top 0.254: J1.3 4.78,3.58 v4.17,4.19 | v8.15,36.22 8.15,34.98 J5.3 8.12,33.38 12.75,28.75 v14.05,28.75 | v22.39,36.14 J6.3 | v27.86,36.04 v32.56,36.04 | v36.63,36.14 36.63,35.02 J7.3 | U1.18 36.87,24.97 40.13,24.97 v40.16,24.99 | v42.72,24.99 IC2.19 | v50.85,36.14 50.85,34.97 J8.3
  Top 0.305: R11.2 15.14,20.8 v15.14,22.33 15.14,24.82 14.51,25.45 U2.7
  Bottom 0.254: v4.17,4.19 4.17,20.12 7.39,23.34 14.12,23.34 15.13,22.34 | 15.13,22.34 v15.14,22.33 | v8.15,36.22 8.74,36.8 22.38,36.8 | v27.86,36.04 27.1,36.8 22.38,36.8 | v22.39,36.14 22.38,36.8 | v32.56,36.04 33.33,36.8 36.63,36.8 | 36.63,36.8 v36.63,36.14 42.14,30.63 43.33,30.63 45.16,28.8 45.16,25.7 44.45,24.99 v42.72,24.99 v40.16,24.99 | v50.85,36.14 50.19,36.8 36.63,36.8 | v14.05,28.75 16.13,26.67 16.13,23.29 15.18,22.34 15.13,22.34
SDA
  Top 0.254: IC3.3 28,25.32 29.9,23.42 29.9,22.43 31.14,21.18 31.96,21.18 U1.19
  Top 0.305: U2.8 15.36,25.95 15.85,26.44 18.04,26.44 R10.2 20.56,26.43 22.2,28.07 27.43,28.07 28,27.5 IC3.3
SS
  Top 0.254: U1.8 38.31,10.54 43.99,10.54 U$2.3
UART_RX  (via drill 0.35)
  Top 0.254: v33.93,24.23 32.28,22.57 U1.20
  Bottom 0.254: J2.1 31.3,35.63 33.93,32.99 v33.93,24.23
UART_TX  (via drill 0.35)
  Top 0.254: v32.77,24.26 U1.21
  Bottom 0.254: J2.2 28.76,36.93 33.27,32.41 33.27,24.77 v32.77,24.26
VBAT
  Top 0.406: IC1.3 5.83,20.95 5.49,21.29 4.12,21.29 D1.A J4.2 C5.2 | C5.2 | R14.1 C5.2 | C5.2
VBUS  (via drill 0.35)
  Top 0.406: U1.7 v35.78,11.94 v35.79,11.94 | C1.2 U4.2 U4.1 | C1.2 | v10.57,13.08 10.57,11.71 C1.2
  Bottom 0.406: S1.2 29.88,6.03 v35.79,11.94 34.65,13.08 v10.57,13.08
VBUS_RAW  (via drill 0.35)
  Top 0.406: v23.11,9.58 LED2.A | CN1.VBUS 11.53,7.59 11.53,9.04 12.06,9.58 v13.16,9.58 14.31,10.73 C4.2 | v6.68,17.27 6.67,17.28 6.67,18.03 IC1.4 5.98,18.35 5.61,17.98 4.12,17.98 D1.C
  Bottom 0.406: S1.3 27.34,7.53 25.3,9.58 v23.11,9.58 v13.16,9.58 10.31,9.58 6.68,13.21 v6.68,17.27
Y5_SDA
  Top 0.254: IC3.5 30.54,27.79 31.29,28.55 38.12,28.55 42.49,24.18 IC2.20